# EAGLE design CAN-BUS-UART_v2 (EAGLE 6.5.0)
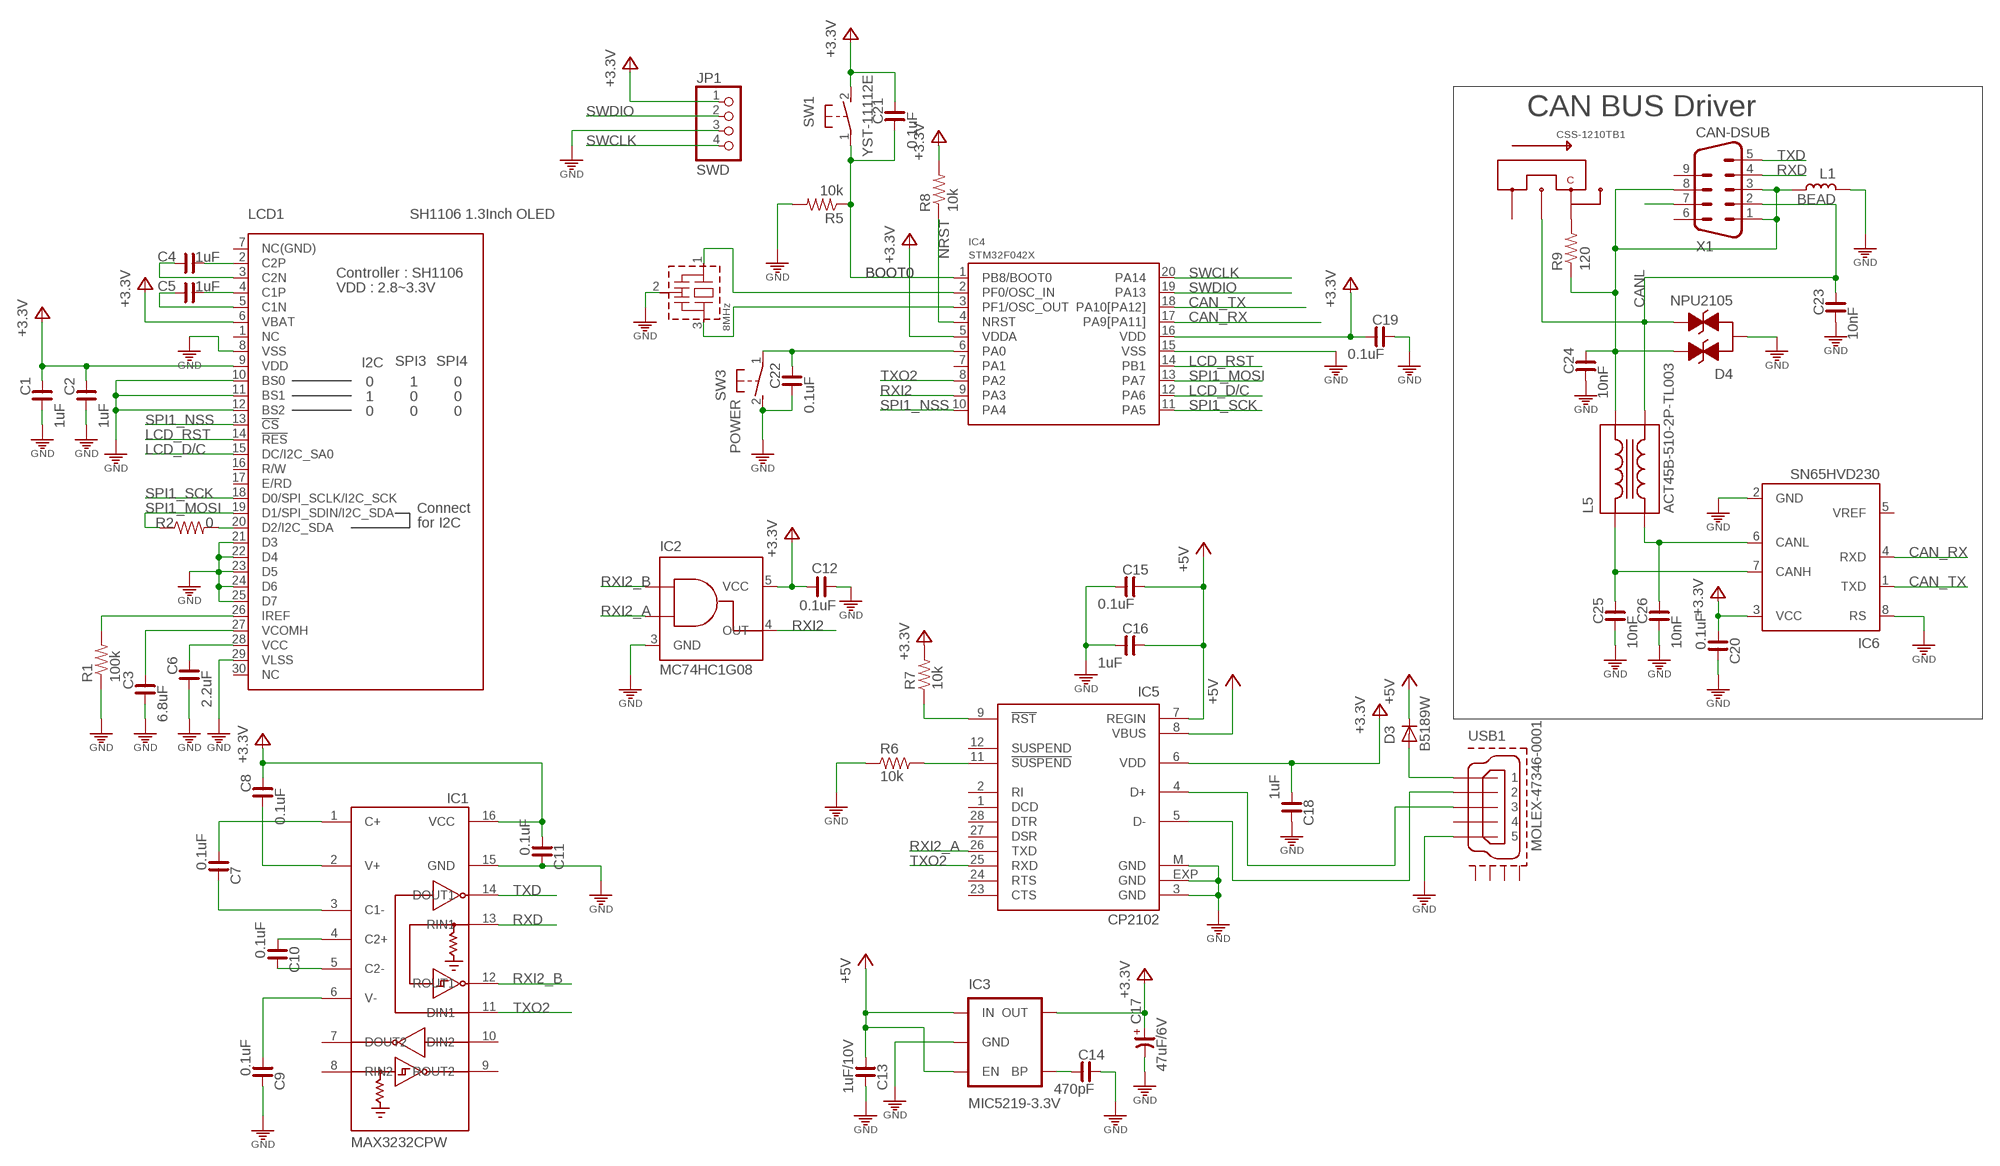
[diagram p0: schematic, sheet 1]

## Parts
C1  1uF  C_0603  [C0603]
C2  1uF  C_0603  [C0603]
C3  6.8uF  C_0805  [C0805]
C4  1uF  C_0603  [C0603]
C5  1uF  C_0603  [C0603]
C6  2.2uF  C_0805  [C0805]
C7  0.1uF  C_0603  [C0603]
C8  0.1uF  C_0603  [C0603]
C9  0.1uF  C_0603  [C0603]
C10  0.1uF  C_0603  [C0603]
C11  0.1uF  C_0603  [C0603]
C12  0.1uF  C_0603  [C0603]
C13  1uF/10V  C_0603  [C0603]
C14  470pF  C_0603  [C0603]
C15  0.1uF  C_0603  [C0603]
C16  1uF  C_0603  [C0603]
C17  47uF/6V  CP_3528-21  [C3528-21/T]
C18  1uF  C_0603  [C0603]
C19  0.1uF  C_0603  [C0603]
C20  0.1uF  C_0603  [C0603]
C21  0.1uF  C_0603  [C0603]
C22  0.1uF  C_0603  [C0603]
C23  10nF  C_0603  [C0603]
C24  10nF  C_0603  [C0603]
C25  10nF  C_0603  [C0603]
C26  10nF  C_0603  [C0603]
D3  B5189W  B5189WN  [SOD323]
D4  NPU2105  [SOT23]
IC1  MAX3232CPW  MAX3232MAX232CPW  [PW_R-PDSO-G16]
IC2  MC74HC1G08  AND_GATE_2INMC74HC1G08  [SOT23-5L_MC74HC1G08]
IC3  MIC5219-3.3V  V_REG_LDOSMD  [SOT23-5]
IC4  STM32F042X  [TSSOP20]
IC5  CP2102  [MLP28]
IC6  SN65HVD230  PCA82C250T  [SO8]
JP1  SWD  PINHD-1X4M  [1X04M]
L1  BEAD  L_0805  [L0805]
L5  ACT45B-510-2P-TL003  CHOKE_COIL  [ACT45B]
LCD1  SH1106 1.3Inch OLED  SH1106_1.3_OLEDBUTTOM  [SH1106_1.3OLED_BUTTOM]
Q1  8MHz  X-TAL-SMALLCSTCE16M00V53  [CSTLA_X]
R1  100k  R-US_R1608  [R0603@1]
R2  0  R-US_R1608  [R0603@1]
R5  10k  R-US_R1608  [R0603@1]
R6  10k  R_0603  [R0603]
R7  10k  R_0603  [R0603]
R8  10k  R-US_R1608  [R0603@1]
R9  120  R-US_R1608  [R0603@1]
SW1  YST-11112E  [YST-1112E]
SW2  CSS-1210TB1  [CSS-1210TB]
SW3  POWER  KLT-1105VE  [KLT-1105VE]
USB1  MOLEX-47346-0001  [MOLEX-47364-0001]
X1  CAN-DSUB  M09KR  [M09H-1]

## Nets
3V3: C1.1 C2.1 C8.1 C11.2 C12.2 C17.+ C18.2 C19.2 C20.2 C21.1 IC1.16(VCC) IC2.5(VCC) IC3.5(OUT) IC4.5(VDDA) IC4.16(VDD) IC5.6(VDD) IC6.3(VCC) JP1.1 LCD1.6(VBAT) LCD1.9(VDD) R7.2 R8.2 SW1.2 ; supply symbol labelled +3V3
+5V: C13.2 C15.1 C16.1 D3.C IC3.1(IN) IC3.3(EN) IC5.7(REGIN) IC5.8(VBUS)
BOOT0: C21.2 IC4.1(PB8/BOOT0) R5.1 SW1.1
CAN_RX: IC4.17(PA9[PA11]) IC6.4(RXD)
CAN_TX: IC4.18(PA10[PA12]) IC6.1(TXD)
CANL: C23.1 D4.S(PIN2) L5.3 SW2.2 X1.2
GND: C1.2 C2.2 C3.2 C6.2 C9.1 C11.1 C12.1 C13.1 C14.1 C15.2 C16.2 C17.- C18.1 C19.1 C20.1 C22.2 C23.2 C24.2 C25.2 C26.2 D4.D(PIN3) IC1.15(GND) IC2.3(GND) IC3.2(GND) IC4.15(VSS) IC5.3(GND) IC5.EXP(GND) IC5.M(GND) IC6.2(GND) IC6.8(RS) JP1.3 L1.2 LCD1.8(VSS) LCD1.10(BS0) LCD1.11(BS1) LCD1.12(BS2) LCD1.21(D3) LCD1.22(D4) LCD1.23(D5) LCD1.24(D6) LCD1.25(D7) LCD1.29(VLSS) Q1.2(GND) R1.1 R5.2 R6.1 SW3.2 USB1.5
LCD_D/C: IC4.12(PA6) LCD1.15(DC/I2C_SA0)
LCD_RST: IC4.14(PB1) LCD1.14(!RES)
N$1: IC5.9(!RST) R7.1
N$2: IC4.2(PF0/OSC_IN) Q1.1(IN)
N$3: IC4.3(PF1/OSC_OUT) Q1.3(OUT)
N$4: D3.A USB1.1
N$5: R9.2 SW2.3
N$6: LCD1.26(IREF) R1.2
N$7: C22.1 IC4.6(PA0) SW3.1
N$8: IC5.5(D-) USB1.2
N$9 [GND]: C24.1 D4.G(PIN1) L1.1 L5.4 R9.1 X1.1 X1.3 X1.8
N$10: C14.2 IC3.4(BP)
N$12: X1.7
N$13: C26.1 IC6.6(CANL) L5.2
N$14: C10.1 IC1.5(C2-)
N$15: C4.2 LCD1.2(C2P)
N$16: C4.1 LCD1.3(C2N)
N$17: C5.2 LCD1.4(C1P)
N$18: C5.1 LCD1.5(C1N)
N$19: LCD1.20(D2/I2C_SDA) R2.2
N$20: IC5.4(D+) USB1.3
N$21: C3.1 LCD1.27(VCOMH)
N$22: C6.1 LCD1.28(VCC)
N$23: IC5.11(!SUSPEND) R6.2
N$24: C25.1 IC6.7(CANH) L5.1
N$25: C10.2 IC1.4(C2+)
N$26: C9.2 IC1.6(V-)
N$27: C7.2 IC1.1(C+)
N$29: C7.1 IC1.3(C1-)
N$31: C8.2 IC1.2(V+)
NRST: IC4.4(NRST) R8.1
RXD: IC1.13(RIN1) X1.4
RXI2: IC2.4(OUT) IC4.9(PA3)
RXI2_A: IC2.2(INA) IC5.26(TXD)
RXI2_B: IC1.12(ROUT1) IC2.1(INB)
SPI1_MOSI: IC4.13(PA7) LCD1.19(D1/SPI_SDIN/I2C_SDA) R2.1
SPI1_NSS: IC4.10(PA4) LCD1.13(!CS)
SPI1_SCK: IC4.11(PA5) LCD1.18(D0/SPI_SCLK/I2C_SCK)
SWCLK: IC4.20(PA14) JP1.4
SWDIO: IC4.19(PA13) JP1.2
TXD: IC1.14(DOUT1) X1.5
TXO2: IC1.11(DIN1) IC4.8(PA2) IC5.25(RXD)
Unconnected: IC1.7(DOUT2) IC1.8(RIN2) IC1.9(ROUT2) IC1.10(DIN2) IC4.7(PA1) IC5.1(DCD) IC5.2(RI) IC5.12(SUSPEND) IC5.23(CTS) IC5.24(RTS) IC5.27(DSR) IC5.28(DTR) IC6.5(VREF) LCD1.1(NC) LCD1.7(NC(GND)) LCD1.16(R/W) LCD1.17(E/RD) LCD1.30(NC) SW2.1 USB1.4 USB1.GND1 USB1.GND2 USB1.GND3 USB1.GND4 X1.6 X1.9

## Notes on the sheet
- CAN BUS Driver

## Library data of the parts
C1-C16 C18-C26 = cona_lib:C_: NON-POLARIZED CAP
C17 = rc-master-smd:CP_: POLARIZED CAP
D3 = cona_lib:B5189W
D4 = cona_lib:NPU2105
IC1 = cona_lib:MAX3232: TI
IC2 = cona_lib:AND_GATE_2IN: MC74HC1G08 CMOS 2 input AND gate
IC3 = SparkFun:V_REG_LDO: Voltage Regulator LDO Standard 150mA LDO voltage regulator in SOT-23 layout. Micrel part MIC5205. BP (by-pass) pin is used to lower output noise with 470pF cap.
IC4 = stm32:STM32F042X
IC5 = silabs:CP210*: Single-Chip USB to UART Bridge Source: www.silabs.com .. CP2101.pdf / cp2102.pdf; MF: FARNELL; MPN: CP2102-GM; OC_FARNELL: 9282130; OC_NEWARK: 30K5635
IC6 = cona_lib:PCA82C250: CAN CONTROLLER INTERFACE
JP1 = pinhead:PINHD-1X4: PIN HEADER
L1 = cona_lib:L_: INDUCTOR
L5 = cona_lib:CHOKE_COIL
LCD1 = OLED_Display:SH1106_1.3_OLED
Q1 = cona_lib:X-TAL-SMALL: Ceramic Resonators MuRata CSTCE08MOOG52A
R1 R2 R5 R8 R9 = cona_lib:R-US_: RESISTOR, American symbol
R6 R7 = cona_lib:R_: RESISTOR
SW1 = switch-tact:YST-11112E
SW2 = cona_lib:CSS-1210TB
SW3 = switch-tact:KLT-1105VE
USB1 = usb_con-update:MOLEX-47346-0001: MICRO USB B, BOTTOM MOUNT
X1 = con-subd:M09: SUB-D

## Net classes
0 default: width 0.178 mm, drill 0.3 mm, clearance 0.178 mm
2 GND: width 0.152 mm, clearance 0.152 mm

## Board
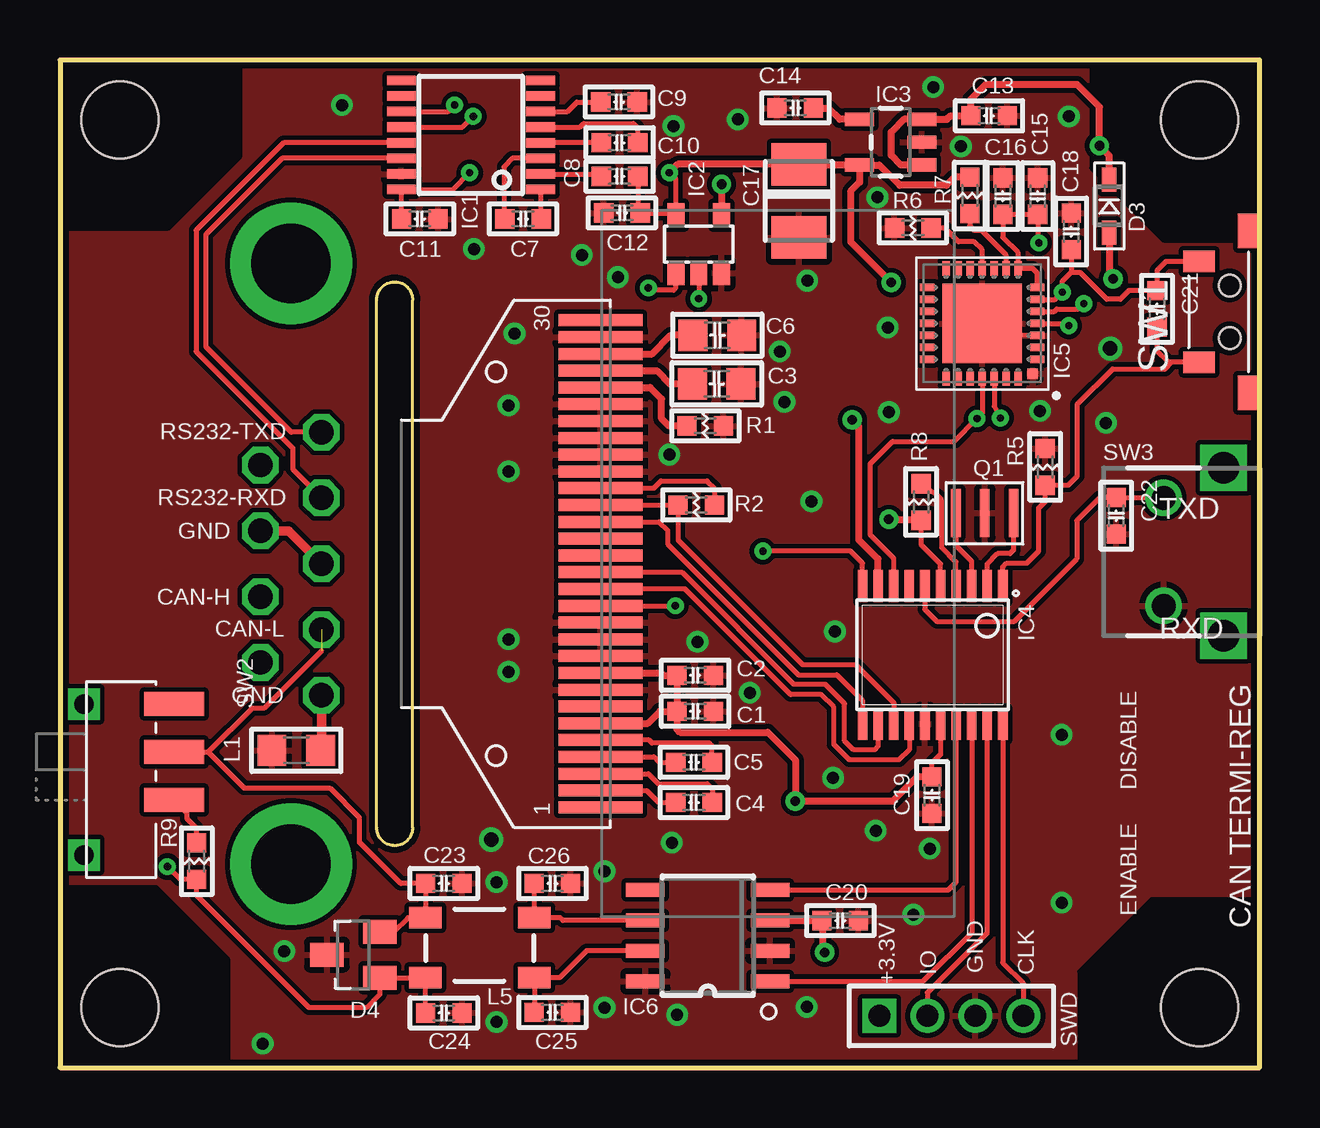
[diagram p1: board, top side]
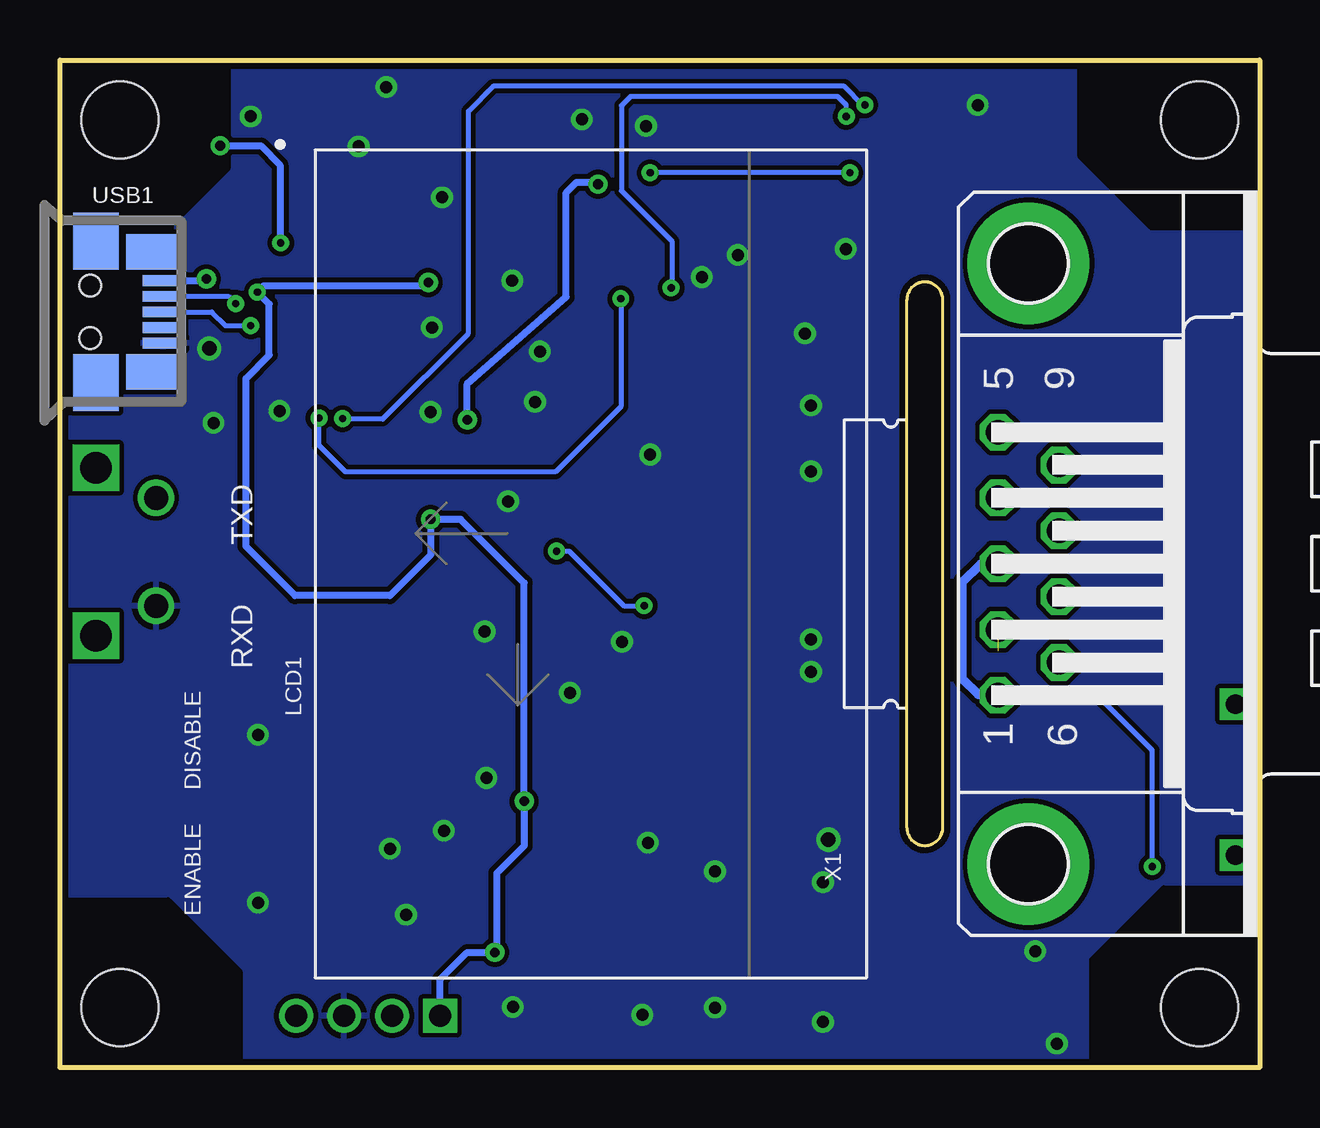
[diagram p2: board, bottom side, seen from below]

Size 50 x 42 mm. Coordinates in mm from the lower left corner, seen from the top.
Outline: 50,0 50,42 0,42 0,0 50,0
Copper layers (1+16): Top 0.035mm / dielectric 1.5mm / Bottom 0.035mm
Design rules "default": minimum track width 0.2mm, minimum drill 0.3mm, track to track 0.2mm, track to pad 0.2mm, pad to pad 0.2mm, via to via 0.2mm, smd to smd 0.2mm, copper to edge 10mil, drill to drill 0.2mm, minimum pad ring 10mil, minimum via ring 8mil, stop-mask expansion 4mil, vias tented up to drill 0mil, thermal gap 10mil
Holes 3.2 mm at 47.5,39.5 2.5,2.5 47.5,2.5 2.5,39.5

### Footprints (pad centres in the part's own frame; a part is rotated, then mirrored left to right if it is on the bottom)
C0603 = smd 0.8 x 0.8: 1 -0.762,0; 2 0.762,0
C0805 = smd 1.2 x 1.3: 1 -1.016,0; 2 1.016,0
C3528-21/T = smd 1.778 x 2.286: + 1.524,0; - -1.524,0
SOD323 = smd 1 x 0.6: A 1.1,0; C -1.1,0
SOT23 = smd 1 x 1.4: D 0,-1.1; G 0.95,1.1; S -0.95,1.1
PW_R-PDSO-G16 = smd 0.4 x 1.2: 1 -2.275,-2.9; 2 -1.625,-2.9; 3 -0.975,-2.9; 4 -0.325,-2.9; 5 0.325,-2.9; 6 0.975,-2.9; 7 1.625,-2.9; 8 2.275,-2.9; 9 2.275,2.9; 10 1.625,2.9; 11 0.975,2.9; 12 0.325,2.9; 13 -0.325,2.9; 14 -0.975,2.9; 15 -1.625,2.9; 16 -2.275,2.9
SOT23-5L_MC74HC1G08 = smd 0.7 x 1: 1 -0.95,-1.2; 2 0,-1.2; 3 0.95,-1.2; 4 0.95,1.2; 5 -0.95,1.2
SOT23-5 = smd 0.55 x 1.2: 1 -0.95,-1.3; 2 0,-1.3; 3 0.95,-1.3; 4 0.95,1.3; 5 -0.95,1.3
TSSOP20 = smd 0.4 x 1.35: 1 -2.925,-2.875; 2 -2.275,-2.875; 3 -1.625,-2.875; 4 -0.975,-2.875; 5 -0.325,-2.875; 6 0.325,-2.875; 7 0.975,-2.875; 8 1.625,-2.875; 9 2.275,-2.875; 10 2.925,-2.875; 11 2.925,2.875; 12 2.275,2.875; 13 1.625,2.875; 14 0.975,2.875; 15 0.325,2.875; 16 -0.325,2.875; 17 -0.975,2.875; 18 -1.625,2.875; 19 -2.275,2.875; 20 -2.925,2.875
MLP28 = smd 0.6 x 0.3: 1 -2.3,1.5; 2 -2.3,1; 3 -2.3,0.5; 4 -2.3,0; 5 -2.3,-0.5; 6 -2.3,-1; 7 -2.3,-1.5; 15 2.3,-1.5; 16 2.3,-1; 17 2.3,-0.5; 18 2.3,0; 19 2.3,0.5; 20 2.3,1; 21 2.3,1.5 | smd 0.3 x 0.6: 8 -1.5,-2.3; 9 -1,-2.3; 10 -0.5,-2.3; 11 0,-2.3; 12 0.5,-2.3; 13 1,-2.3; 14 1.5,-2.3; 22 1.5,2.3; 23 1,2.3; 24 0.5,2.3; 25 0,2.3; 26 -0.5,2.3; 27 -1,2.3; 28 -1.5,2.3 | smd 3.3 x 3.3: EXP 0,0 | smd 0.435 x 0.435: M -2.103,2.103
SO8 = smd 0.6 x 1.6: 1 -1.905,-2.6; 2 -0.635,-2.6; 3 0.635,-2.6; 4 1.905,-2.6; 5 1.905,2.6; 6 0.635,2.6; 7 -0.635,2.6; 8 -1.905,2.6
1X04M = drill 0.914 square: 1 -3,0 | drill 0.914: 2 -1,0; 3 1,0; 4 3,0
L0805 = smd 1.2 x 1.3: 1 -1.016,0; 2 1.016,0
ACT45B = smd 1.35 x 0.9: 1 -2.275,1.25; 2 -2.275,-1.25; 3 2.275,-1.25; 4 2.275,1.25
SH1106_1.3OLED_BUTTOM = smd 0.5 x 3.5: 1 10.15,-5.97; 2 9.45,-5.97; 3 8.75,-5.97; 4 8.05,-5.97; 5 7.35,-5.97; 6 6.65,-5.97; 7 5.95,-5.97; 8 5.25,-5.97; 9 4.55,-5.97; 10 3.85,-5.97; 11 3.15,-5.97; 12 2.45,-5.97; 13 1.75,-5.97; 14 1.05,-5.97; 15 0.35,-5.97; 16 -0.35,-5.97; 17 -1.05,-5.97; 18 -1.75,-5.97; 19 -2.45,-5.97; 20 -3.15,-5.97; 21 -3.85,-5.97; 22 -4.55,-5.97; 23 -5.25,-5.97; 24 -5.95,-5.97; 25 -6.65,-5.97; 26 -7.35,-5.97; 27 -8.05,-5.97; 28 -8.75,-5.97; 29 -9.45,-5.97; 30 -10.15,-5.97
CSTLA_X = smd 0.4 x 2: 1 -1.19,-0.02; 2 0.01,-0.02; 3 1.21,-0.02
R0603@1 = smd 0.8 x 0.8: 1 -0.762,0; 2 0.762,0
R0603 = smd 0.8 x 0.8: 1 -0.762,0; 2 0.762,0
YST-1112E = smd 0.9 x 1.3: 1 -2.1,1.025; 2 2.1,1.025 | smd 1.45 x 0.8: SH -3.375,-1; SH@1 3.375,-1 | hole 0.9: 1.1,-0.25; -1.1,-0.25
CSS-1210TB = smd 1 x 2.5: 1 -3.15,3.75; 2 -1.15,3.75; 3 0.85,3.75 | drill 0.8 square: P$1 -3.15,0; P$2 3.15,0
KLT-1105VE = drill 1: 1 0,2.25; 2 0,-2.25 | drill 1.3 square: H1 2.5,3.5; H2 2.5,-3.5
MOLEX-47364-0001 = smd 1.7 x 0.45: 1 2.8,1.3; 2 2.8,0.65; 3 2.8,0; 4 2.8,-0.65; 5 2.8,-1.3 | smd 1.9 x 2.375: GND1 0,2.95; GND4 0,-2.95 | smd 2.1 x 1.475: GND2 2.3,2.5; GND3 2.3,-2.5
M09H-1 = drill 1.016 octagon: 1 -5.486,0; 2 -2.743,0; 3 0,0; 4 2.743,0; 5 5.486,0; 6 -4.115,-2.54; 7 -1.372,-2.54; 8 1.372,-2.54; 9 4.115,-2.54 | drill 3.302 pad 5.08: G1 -12.522,-1.27; G2 12.522,-1.27

### Placement (x,y rotation side)
C1  26.48,14.85 0 top
C2  26.48,16.35 0 top
C3  27.38,28.5 0 top
C4  26.43,11.05 180 top
C5  26.43,12.72 180 top
C6  27.4,30.52 0 top
C7  19.3,35.38 0 top
C8  23.32,37.15 180 top
C9  23.3,40.25 180 top
C10  23.32,38.55 180 top
C11  15,35.38 180 top
C12  23.43,35.62 0 top
C13  38.73,39.67 180 top
C14  30.65,40 0 top
C15  40.75,36.33 90 top
C16  39.3,36.33 90 top
C17  30.8,36.12 90 top
C18  42.15,34.85 270 top
C19  36.34,11.36 90 top
C20  32.52,6.12 180 top
C21  45.73,31.62 270 top
C22  44.02,23 270 top
C23  16,7.68 0 top
C24  16,2.27 0 top
C25  20.52,2.3 0 top
C26  20.52,7.68 0 top
D3  43.73,35.91 270 top
D4  12.23,4.7 270 top
IC1  17.12,38.88 90 top
IC2  26.62,34.33 0 top
IC3  34.62,38.58 90 top
IC4  36.38,17.2 180 top
IC5  38.44,31.02 180 top
IC6  27,5.5 90 top
JP1  37.16,2.16 0 top
L1  9.85,13.22 180 top
L5  17.5,5 180 top
LCD1  28.5,21 270 top
Q1  38.55,23.09 180 top
R1  26.9,26.75 180 top
R2  26.52,23.45 0 top
R5  41.06,25.04 90 top
R6  35.55,35 0 top
R7  37.92,36.35 90 top
R8  35.9,23.57 270 top
R9  5.7,8.6 90 top
SW1  48.5,31.5 90 top
SW2  1,12 270 top
SW3  46,21.5 0 top
USB1  48.5,31.5 0 bottom
X1  10.9,21 90 bottom

### Tracks (layer width: path | path; a pad name or v marks a point on that pad's centre or on a via)
3V3  (via drill 0.3, 0.4)
  Top 0.2: C18.2 42.15,33.15 | 42.15,33.15 41.77,32.77 v41.77,32.33 41.47,32.02 IC5.6 | C8.1 24.09,35.73 C12.2 25.57,35.62 IC2.5 25.65,35.55 25.65,37.08 25.43,37.3 v25.4,37.3 | C11.2 14.24,36.59 IC1.16 16.38,36.6 v17.07,37.3 | IC4.5 36.7,21 35.9,21.8 R8.2 | IC4.16 36.7,13.05 36.34,12.7 C19.2 | SW1.2 46.1,33.6 45.73,33.23 C21.1 44.56,32.39 44.2,32.02 43.62,32.02 42.5,33.15 42.15,33.15
  Top 0.3: IC6.3 31.75,6.13 C20.2 31.77,6.11 31.77,4.9 v31.88,4.8 | LCD1.6 24.5,14.35 25,14.85 C1.1 | LCD1.9 25.05,16.45 25.15,16.35 C2.1 C1.1 | C1.1 25.71,14.11 25.85,13.97 29.5,13.97 30.65,12.82 v30.65,11.1 34.7,11.1 35.72,12.12 C19.2 | IC3.5 30.82,37.62 C17.+ 25.75,37.65 v25.4,37.3 | IC3.5 34.15,37.62 35,36.77 36.95,36.77 37.29,37.11 R7.2 | v34.55,22.85 35.86,22.85 R8.2 | IC3.5 33.33,36.9 32.95,36.52 32.95,34.42 v34.65,32.73
  Bottom 0.2: v17.07,37.3 v25.4,37.3
  Bottom 0.3: 31.77,4.9 v31.88,4.8 | v34.65,32.73 34.8,32.58 41.52,32.58 v41.77,32.33 41.27,31.82 41.27,29.7 42.25,28.73 42.25,21.73 40.2,19.68 36.25,19.68 34.55,21.38 v34.55,22.85 33.3,22.85 30.65,20.2 v30.65,11.1 30.65,9.25 31.8,8.1 31.8,4.88 v31.88,4.8 | JP1.1 34.16,3.67 33.02,4.8 v31.88,4.8
+5V  (via drill 0.3, 0.4)
  Top 0.2: v40.8,34.38 40.75,34.42 C15.1 C16.1 39.3,34.6 39.94,33.96 IC5.8 40.53,33.32 40.74,33.11 IC5.7
  Top 0.3: D3.C 43.73,38.02 v43.33,38.42 43.33,40.05 42.4,40.98 38.58,40.98 37.95,40.35 C13.2 37.12,39.67 36.98,39.52 IC3.3 35.17,39.52 34.65,39 34.65,38.02 35.05,37.62 IC3.1
  Bottom 0.2: 40.9,34.27 v40.8,34.38
  Bottom 0.3: v43.33,38.42 41.62,38.42 40.83,37.62 40.83,34.4 v40.8,34.38
BOOT0
  Top 0.2: IC4.1 39.3,20.88 39.45,21.02 40.3,21.02 40.8,21.52 40.8,23.32 41.08,23.6 41.08,24.26 R5.1 42.02,24.27 42.4,24.65 42.4,27.65 43.88,29.12 46.08,29.12 46.35,29.4 | SW1.1 46.35,29.4 | 46.35,29.4 46.2,29.4 45.73,29.88 C21.2
CAN_RX
  Top 0.2: IC6.4 37.02,7.4 37.35,7.72 IC4.17
CAN_TX
  Top 0.2: IC4.18 38,5.62 35.97,3.59 IC6.1
CANL  (1 unrouted)
  Top 0.2: SW2.2 6.18,13.15 | 6.18,13.15 7.68,11.65 11.25,11.65 12.48,10.43 12.48,9.4 14.2,7.68 C23.1 15.24,6.26 L5.3 14.5,6.25 13.9,5.65 D4.S | 10.9,17.38 8.5,14.97 8,14.97 6.18,13.15
GND  (via drill 0.5, 0.6)
  Top 0.2: IC5.3 39.02,30.55 IC5.EXP
  other vias: 25.57,39.25 42.05,39.65 37.55,38.4 43.77,29.98 17.98,9.5 31.15,32.8 30,29.85 30.2,27.75 31.32,23.6 28.75,15.62 26.57,17.75 32.3,18.18 32.23,12.07 18.7,17.85 18.7,16.5 18.7,24.85 18.7,27.6 18.95,30.6 25.4,25.55 17.25,34.12 21.75,33.88 41.75,13.88 36.25,9.12 22.7,2.5 22.7,8.18 23.25,32.95 34.08,36.27 34.5,30.85 34.55,27.32 40.85,27.38 43.6,26.88 34,9.88 25.5,9.38 35.58,6.38 41.75,6.88 11.75,40.12 8.45,1 36.4,40.88 28.25,39.52 18.2,1.9 18.2,7.72 25.73,2.2 9.35,4.85 31.12,2.52
  pour Top (rank 3): 0,0 0,42 50,42 50,0
  pour Bottom (rank 2): 0,0 0,42 50,42 50,0
LCD_D/C
  Top 0.2: LCD1.15 25.93,20.65 30.6,15.97 31.9,15.97 32.7,15.18 32.7,13.62 33.08,13.25 33.95,13.25 34.1,13.4 IC4.12
LCD_RST
  Top 0.2: IC4.14 35.4,13.25 34.98,12.82 32.9,12.82 32.25,13.47 32.25,15.03 31.73,15.55 30.45,15.55 26.05,19.95 LCD1.14
N$1
  Top 0.2: IC5.9 39.44,33.86 38.4,34.9 38.1,34.9 37.92,35.08 R7.1
N$2
  Top 0.2: IC4.2 38.65,21 39.08,21.43 39.6,21.43 39.74,21.57 Q1.1
N$3
  Top 0.2: IC4.3 38,21.1 37.34,21.75 Q1.3
N$4  (via drill 0.4)
  Top 0.3: D3.A 43.73,33.04 v43.9,32.88
  Bottom 0.3: USB1.1 43.98,32.8 v43.9,32.88
N$5
  Top 0.2: R9.2 5.7,9.97 5.3,10.38 5.3,10.6 SW2.3
N$6
  Top 0.3: LCD1.26 24.6,28.35 25.07,27.88 25.07,27.05 25.38,26.75 R1.2
N$7
  Top 0.2: IC4.6 36.05,19.1 36.55,18.6 39.77,18.6 42.38,21.2 42.38,22.8 43.34,23.76 C22.1 SW3.1
N$8  (via drill 0.3)
  Top 0.2: IC5.5 41.45,31.52 41.55,31.62 42.45,31.62 v42.67,31.85
  Bottom 0.2: USB1.2 42.98,32.15 v42.67,31.85
N$9  (via drill 0.3)
  Top 0.2: C24.1 15.23,2.29 L5.4 D4.G 13.32,3.05 12.77,2.5 10.38,2.5 5.7,7.18 R9.1 5.01,7.84 v4.48,8.38
  Top 0.4: X1.1 10.9,13.26 L1.1 | X1.8 9.53,22.37 X1.3
  Bottom 0.2: v4.48,8.38 4.48,13.22 6.75,15.5 10.89,15.5 X1.1
  Bottom 0.4: X1.3 11.62,21 12.4,20.23 12.4,16.23 11.73,15.55 10.94,15.55 X1.1
N$10
  Top 0.3: IC3.4 32.5,39.52 32.05,39.98 31.44,39.98 C14.2
N$11
  cutout Bottom (no thermals): 50,7 45.5,7 42.5,4 42.5,0 50,0
  cutout Top (no thermals): 50,7 45.5,7 42.5,4 42.5,0 50,0
  cutout Top (no thermals): 7,0 7,4.5 4,7.5 0,7.5 0,0
  cutout Bottom (no thermals): 7,0 7,4.5 4,7.5 0,7.5 0,0
  cutout Top (no thermals): 43,42 43,37.5 46,34.5 50,34.5 50,42
  cutout Bottom (no thermals): 43,42 43,37.5 46,34.5 50,34.5 50,42
  cutout Bottom (no thermals): 0,35 4.5,35 7.5,38 7.5,42 0,42
  cutout Top (no thermals): 0,35 4.5,35 7.5,38 7.5,42 0,42
N$13
  Top 0.2: IC6.6 20.96,6.13 20.85,6.25 L5.2 19.77,7.66 C26.1
N$14
  Top 0.2: IC1.5 21.68,39.2 21.82,39.35 23.9,39.35 24.07,39.17 24.07,38.56 C10.1
N$15
  Top 0.2: LCD1.2 24.45,11.55 24.95,11.05 C4.2
N$16
  Top 0.2: C4.1 27.2,11.06 27.2,11.6 26.98,11.82 24.95,11.82 24.52,12.25 LCD1.3
N$17
  Top 0.2: C5.2 24.98,12.72 24.75,12.95 LCD1.4
N$18
  Top 0.2: C5.1 27.19,13.41 27.07,13.53 24.68,13.53 24.55,13.65 LCD1.5
N$19
  Top 0.2: LCD1.20 24.75,24.15 25.05,24.45 26.98,24.45 27.27,24.15 27.27,23.46 R2.2
N$20  (via drill 0.3)
  Top 0.2: IC5.4 41.95,31.02 v42.05,30.93
  Bottom 0.2: USB1.3 43.67,31.5 43.1,30.93 v42.05,30.93
N$21
  Top 0.3: LCD1.27 24.88,29.05 25.43,28.5 C3.1
N$22
  Top 0.3: LCD1.28 24.68,29.75 25.45,30.52 C6.1
N$23
  Top 0.2: IC5.11 38.44,34.09 38.1,34.42 37.45,34.42 36.88,35 R6.2
N$24
  Top 0.2: IC6.7 21.94,4.86 20.82,3.75 L5.1 19.77,2.31 C25.1
N$25
  Top 0.2: C10.2 IC1.4
N$26
  Top 0.2: IC1.6 21.15,39.85 21.55,40.25 C9.2
N$27
  Top 0.2: C7.2 20.06,36.56 IC1.1
N$29
  Top 0.2: IC1.3 18.85,37.9 18.5,37.55 18.5,35.41 C7.1
N$31
  Top 0.2: IC1.2 22.46,37.25 C8.2
NRST
  Top 0.2: IC4.4 37.35,21.07 36.75,21.68 36.75,23.65 36.56,23.84 R8.1
RXD
  Top 0.2: IC1.13 9.32,38.55 5.68,34.9 5.68,29.85 9.7,25.82 9.7,24.94 X1.4
RXI2  (via drill 0.4)
  Top 0.3: v27.57,36.83 IC2.4 | v33.02,27 33.3,26.73 33.3,22 34.1,21.2 IC4.9
  Bottom 0.3: v33.02,27 33.02,28.5 28.9,32.12 28.9,36.48 28.48,36.9 27.65,36.9 v27.57,36.83
RXI2_A  (via drill 0.3)
  Top 0.2: IC5.26 38.94,27.57 v39.2,27.07 | IC2.2 v26.62,32.05
  Bottom 0.2: v26.62,32.05 26.62,27.55 29.35,24.82 38.1,24.82 39.2,25.93 v39.2,27.07
RXI2_B  (via drill 0.3)
  Top 0.2: IC1.12 16.77,39.2 v17.23,39.65 | IC2.1 25.65,33.1 25.65,32.48 25.57,32.4 24.62,32.4 v24.52,32.5
  Bottom 0.2: v17.23,39.65 17.23,40.12 17.57,40.48 26.23,40.48 26.6,40.1 26.6,36.55 24.5,34.45 24.5,32.52 v24.52,32.5
SPI1_MOSI
  Top 0.2: LCD1.19 R2.1 25.76,21.99 30.95,16.8 33.15,16.8 34.75,15.2 IC4.13
SPI1_NSS  (via drill 0.3)
  Top 0.2: LCD1.13 v25.65,19.25 | IC4.10 33.45,21.02 32.95,21.52 v29.3,21.52
  Bottom 0.2: 25.77,19.25 v25.65,19.25 26.5,19.25 28.77,21.52 v29.3,21.52
SPI1_SCK
  Top 0.2: LCD1.18 24.98,22.75 25.32,22.4 25.32,21.82 30.77,16.38 32.38,16.38 33.45,15.3 IC4.11
SWCLK
  Top 0.2: IC4.20 39.3,4.38 40.15,3.52 JP1.4
SWDIO
  Top 0.2: IC4.19 38.65,5.62 36.15,3.12 JP1.2
TXD
  Top 0.2: IC1.14 9.25,37.9 6.07,34.73 6.07,30.05 9.64,26.49 X1.5
TXO2  (via drill 0.3)
  Top 0.2: IC1.11 16.18,39.85 v16.45,40.12 | IC5.25 38.44,27.27 v38.23,27.05 37.27,26.1 34.7,26.1 33.77,25.18 33.77,22.2 34.75,21.23 IC4.8
  Bottom 0.2: v16.45,40.12 16.52,40.12 17.3,40.9 31.95,40.9 32.98,39.88 32.98,30.6 36.55,27.02 38.2,27.02 v38.23,27.05

### Text on the board
_tsilk: RS232-TXD | RS232-RXD | GND | TXD | CAN-H | CAN-L | RXD | GND | DISABLE | ENABLE | CAN TERMI-REG | IO | GND | CLK | +3.3V | SWD
_bsilk: TXD | RXD | DISABLE | ENABLE